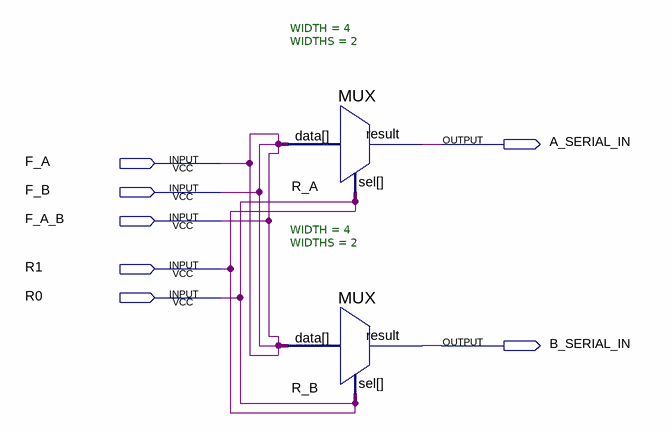
[diagram p0: schematic sheet]
// Quartus schematic Routing.bdf as structural Verilog: 2 symbols, 7 pins
module Routing (
  input  F_A,
  input  F_B,
  input  F_A_B,
  input  R1,
  input  R0,
  output A_SERIAL_IN,
  output B_SERIAL_IN
);

  wire [1:0] undriven, undriven_4;
  wire [3:0] undriven_2, undriven_3;

  MUX #(.WIDTH(4), .WIDTHS(2)) R_A (.data(undriven_2), .sel(undriven), .result(A_SERIAL_IN));
  MUX #(.WIDTH(4), .WIDTHS(2)) R_B (.data(undriven_3), .sel(undriven_4), .result(B_SERIAL_IN));
endmodule
